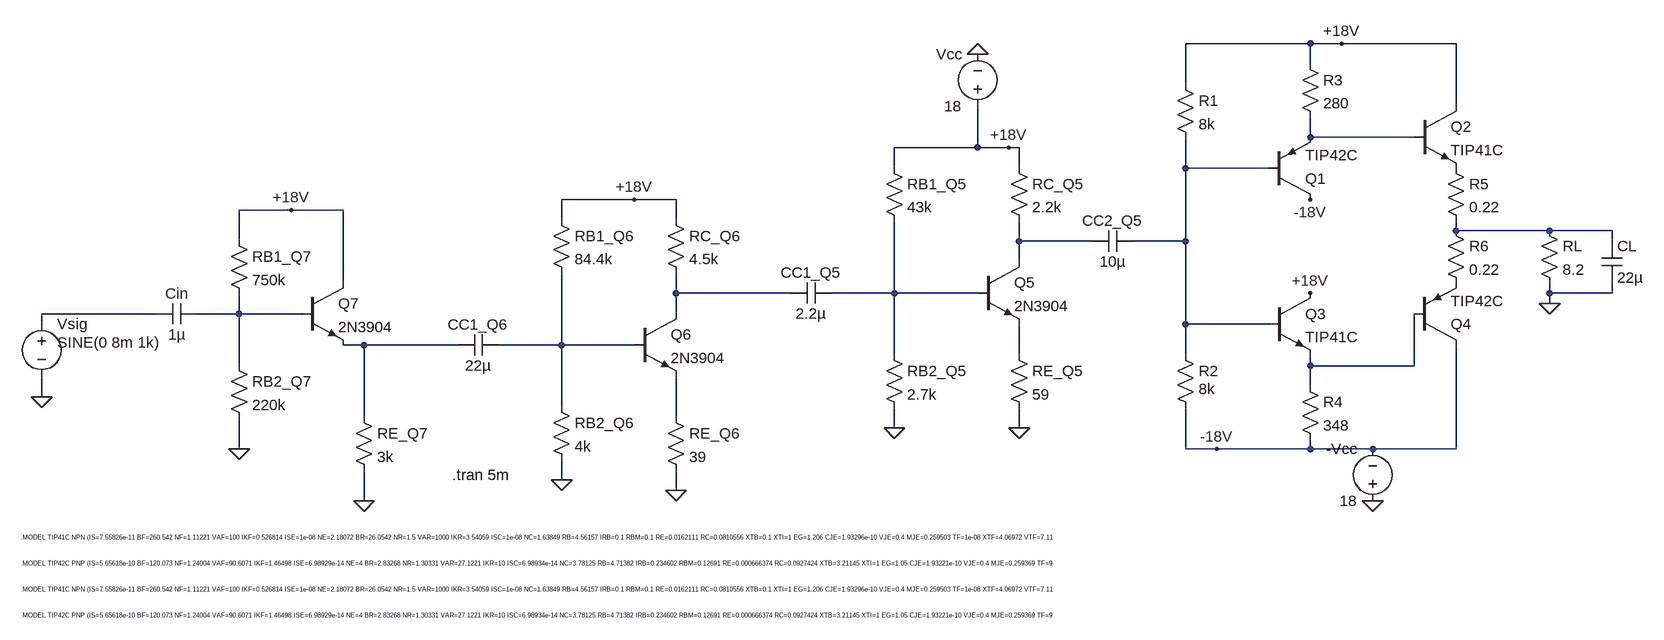
[diagram p0: schematic Simulation (LTSpice).asc]
Simulation (LTSpice).asc, the LTspice schematic file:
Version 4.1
SHEET 1 4752 884
WIRE 1568 -192 1376 -192
WIRE 1616 -192 1568 -192
WIRE 1792 -192 1616 -192
WIRE 1568 -160 1568 -192
WIRE 1376 -128 1376 -192
WIRE 1792 -96 1792 -192
WIRE 1568 -48 1568 -80
WIRE 1728 -48 1568 -48
WIRE 1056 -32 1056 -96
WIRE 1056 -32 928 -32
WIRE 1104 -32 1056 -32
WIRE 1120 -32 1104 -32
WIRE 928 0 928 -32
WIRE 1120 0 1120 -32
WIRE 1376 0 1376 -48
WIRE 1504 0 1376 0
WIRE 528 48 416 48
WIRE 592 48 528 48
WIRE 0 64 -80 64
WIRE 80 64 0 64
WIRE 416 80 416 48
WIRE 592 80 592 48
WIRE 1792 96 1792 80
WIRE 1936 96 1792 96
WIRE 2032 96 1936 96
WIRE -80 112 -80 64
WIRE 1120 112 1120 80
WIRE 1232 112 1120 112
WIRE 1376 112 1376 0
WIRE 1376 112 1296 112
WIRE 2032 112 2032 96
WIRE 1120 144 1120 112
WIRE 80 176 80 64
WIRE 592 192 592 160
WIRE 768 192 592 192
WIRE 928 192 928 80
WIRE 928 192 832 192
WIRE 1056 192 928 192
WIRE 1936 192 1936 176
WIRE 2032 192 2032 176
WIRE 2032 192 1936 192
WIRE 1936 208 1936 192
WIRE -208 224 -384 224
WIRE -80 224 -80 192
WIRE -80 224 -144 224
WIRE 16 224 -80 224
WIRE 592 224 592 192
WIRE -384 240 -384 224
WIRE 1376 240 1376 112
WIRE 1504 240 1376 240
WIRE 112 272 80 272
WIRE 256 272 112 272
WIRE 416 272 416 160
WIRE 416 272 320 272
WIRE 528 272 416 272
WIRE 928 288 928 192
WIRE 1120 288 1120 240
WIRE 1376 288 1376 240
WIRE -80 304 -80 224
WIRE 1568 304 1568 288
WIRE 1728 304 1728 224
WIRE 1728 304 1568 304
WIRE 1568 336 1568 304
WIRE -384 352 -384 320
WIRE 416 368 416 272
WIRE 112 384 112 272
WIRE 592 384 592 320
WIRE 928 400 928 368
WIRE 1120 400 1120 368
WIRE -80 432 -80 384
WIRE 1376 432 1376 368
WIRE 1424 432 1376 432
WIRE 1568 432 1568 416
WIRE 1568 432 1424 432
WIRE 1664 432 1568 432
WIRE 1792 432 1792 272
WIRE 1792 432 1664 432
WIRE 416 480 416 448
WIRE 592 496 592 464
WIRE 112 512 112 464
FLAG 928 400 0
FLAG 1056 -176 0
FLAG 1104 -32 +18V
FLAG 416 480 0
FLAG 528 48 +18V
FLAG -80 432 0
FLAG 112 512 0
FLAG -384 352 0
FLAG 1120 400 0
FLAG 592 496 0
FLAG 1936 208 0
FLAG 1616 -192 +18V
FLAG 1568 192 +18V
FLAG 1568 48 -18V
FLAG 1424 432 -18V
FLAG 1664 512 0
FLAG 0 64 +18V
SYMBOL npn 1056 144 R0
SYMATTR InstName Q5
SYMATTR Value 2N3904
SYMBOL res 1104 -16 R0
SYMATTR InstName RC_Q5
SYMATTR Value 2.2k
SYMBOL res 912 -16 R0
SYMATTR InstName RB1_Q5
SYMATTR Value 43k
SYMBOL res 912 272 R0
SYMATTR InstName RB2_Q5
SYMATTR Value 2.7k
SYMBOL res 1104 272 R0
SYMATTR InstName RE_Q5
SYMATTR Value 59
SYMBOL voltage 1056 -80 R180
WINDOW 0 24 96 Left 2
WINDOW 3 24 16 Left 2
WINDOW 123 0 0 Left 0
WINDOW 39 0 0 Left 0
SYMATTR InstName Vcc
SYMATTR Value 18
SYMBOL npn 528 224 R0
SYMATTR InstName Q6
SYMATTR Value 2N3904
SYMBOL res 576 64 R0
SYMATTR InstName RC_Q6
SYMATTR Value 4.5k
SYMBOL res 400 64 R0
SYMATTR InstName RB1_Q6
SYMATTR Value 84.4k
SYMBOL res 400 352 R0
SYMATTR InstName RB2_Q6
SYMATTR Value 4k
SYMBOL cap 1296 96 R90
WINDOW 0 0 32 VBottom 2
WINDOW 3 32 32 VTop 2
SYMATTR InstName CC2_Q5
SYMATTR Value 10µ
SYMBOL npn 16 176 R0
SYMATTR InstName Q7
SYMATTR Value 2N3904
SYMBOL res 96 368 R0
SYMATTR InstName RE_Q7
SYMATTR Value 3k
SYMBOL res -96 96 R0
SYMATTR InstName RB1_Q7
SYMATTR Value 750k
SYMBOL res -96 288 R0
SYMATTR InstName RB2_Q7
SYMATTR Value 220k
SYMBOL cap -144 208 R90
WINDOW 0 0 32 VBottom 2
WINDOW 3 32 32 VTop 2
SYMATTR InstName Cin
SYMATTR Value 1µ
SYMBOL voltage -384 224 R0
WINDOW 3 24 44 Left 2
WINDOW 123 24 44 Left 2
WINDOW 39 0 0 Left 0
SYMATTR Value SINE(0 8m 1k)
SYMATTR InstName Vsig
SYMBOL cap 320 256 R90
WINDOW 0 0 32 VBottom 2
WINDOW 3 32 32 VTop 2
SYMATTR InstName CC1_Q6
SYMATTR Value 22µ
SYMBOL cap 832 176 R90
WINDOW 0 0 32 VBottom 2
WINDOW 3 32 32 VTop 2
SYMATTR InstName CC1_Q5
SYMATTR Value 2.2µ
SYMBOL res 576 368 R0
SYMATTR InstName RE_Q6
SYMATTR Value 39
SYMBOL npn 1504 192 R0
SYMATTR InstName Q3
SYMATTR Value TIP41C
SYMBOL npn 1728 -96 R0
SYMATTR InstName Q2
SYMATTR Value TIP41C
SYMBOL pnp 1504 48 M180
SYMATTR InstName Q1
SYMATTR Value TIP42C
SYMBOL pnp 1728 272 M180
SYMATTR InstName Q4
SYMATTR Value TIP42C
SYMBOL res 1552 -176 R0
SYMATTR InstName R3
SYMATTR Value 280
SYMBOL res 1552 320 R0
SYMATTR InstName R4
SYMATTR Value 348
SYMBOL res 1776 -16 R0
SYMATTR InstName R5
SYMATTR Value 0.22
SYMBOL res 1776 80 R0
SYMATTR InstName R6
SYMATTR Value 0.22
SYMBOL res 1920 80 R0
SYMATTR InstName RL
SYMATTR Value 8.2
SYMATTR SpiceLine pwr=5
SYMBOL voltage 1664 528 R180
WINDOW 0 24 96 Left 2
WINDOW 3 24 16 Left 2
WINDOW 123 0 0 Left 0
WINDOW 39 0 0 Left 0
SYMATTR InstName -Vcc
SYMATTR Value 18
SYMBOL res 1360 -144 R0
SYMATTR InstName R1
SYMATTR Value 8k
SYMBOL res 1360 272 R0
WINDOW 3 36 68 Left 2
SYMATTR Value 8k
SYMATTR InstName R2
SYMBOL cap 2016 112 R0
SYMATTR InstName CL
SYMATTR Value 22µ
TEXT 248 472 Left 2 !.tran 5m
TEXT -416 568 Left 0 !.MODEL TIP41C NPN (IS=7.55826e-11 BF=260.542 NF=1.11221 VAF=100 IKF=0.526814 ISE=1e-08 NE=2.18072 BR=26.0542 NR=1.5 VAR=1000 IKR=3.54059 ISC=1e-08 NC=1.63849 RB=4.56157 IRB=0.1 RBM=0.1 RE=0.0162111 RC=0.0810556 XTB=0.1 XTI=1 EG=1.206 CJE=1.93296e-10 VJE=0.4 MJE=0.259503 TF=1e-08 XTF=4.06972 VTF=7.1157 ITF=0.001 CJC=1.09657e-10 VJC=0.730921 MJC=0.23 XCJC=0.803085 FC=0.8 TR=9.01013e-08 PTF=0 Vceo=100 ICrating=6 mfg=ON_Semi)
TEXT -416 608 Left 0 !.MODEL TIP42C PNP (IS=5.65618e-10 BF=120.073 NF=1.24004 VAF=90.6071 IKF=1.46498 ISE=6.98929e-14 NE=4 BR=2.83268 NR=1.30331 VAR=27.1221 IKR=10 ISC=6.98934e-14 NC=3.78125 RB=4.71382 IRB=0.234602 RBM=0.12691 RE=0.000666374 RC=0.0927424 XTB=3.21145 XTI=1 EG=1.05 CJE=1.93221e-10 VJE=0.4 MJE=0.259369 TF=9.99163e-09 XTF=4.41941 VTF=6.53488 ITF=0.001 CJC=1.0962e-10 VJC=0.731968 MJC=0.23 XCJC=0.799902 FC=0.799995 TR=1e-07 PTF=0 KF=0 Vceo=100 ICrating=6 mfg=ON_Semi)
TEXT -416 648 Left 0 !.MODEL TIP41C NPN (IS=7.55826e-11 BF=260.542 NF=1.11221 VAF=100 IKF=0.526814 ISE=1e-08 NE=2.18072 BR=26.0542 NR=1.5 VAR=1000 IKR=3.54059 ISC=1e-08 NC=1.63849 RB=4.56157 IRB=0.1 RBM=0.1 RE=0.0162111 RC=0.0810556 XTB=0.1 XTI=1 EG=1.206 CJE=1.93296e-10 VJE=0.4 MJE=0.259503 TF=1e-08 XTF=4.06972 VTF=7.1157 ITF=0.001 CJC=1.09657e-10 VJC=0.730921 MJC=0.23 XCJC=0.803085 FC=0.8 TR=9.01013e-08 PTF=0 Vceo=100 ICrating=6 mfg=ON_Semi)
TEXT -416 688 Left 0 !.MODEL TIP42C PNP (IS=5.65618e-10 BF=120.073 NF=1.24004 VAF=90.6071 IKF=1.46498 ISE=6.98929e-14 NE=4 BR=2.83268 NR=1.30331 VAR=27.1221 IKR=10 ISC=6.98934e-14 NC=3.78125 RB=4.71382 IRB=0.234602 RBM=0.12691 RE=0.000666374 RC=0.0927424 XTB=3.21145 XTI=1 EG=1.05 CJE=1.93221e-10 VJE=0.4 MJE=0.259369 TF=9.99163e-09 XTF=4.41941 VTF=6.53488 ITF=0.001 CJC=1.0962e-10 VJC=0.731968 MJC=0.23 XCJC=0.799902 FC=0.799995 TR=1e-07 PTF=0 KF=0 Vceo=100 ICrating=6 mfg=ON_Semi)

The netlist it stands for:
* Simulation (LTSpice).asc
Q5 N004 N006 N011 0 2N3904
RC_Q5 +18V N004 2.2k
RB1_Q5 +18V N006 43k
RB2_Q5 N006 0 2.7k
RE_Q5 N011 0 59
Vcc +18V 0 18
Q6 N005 N010 N013 0 2N3904
RC_Q6 +18V N005 4.5k
RB1_Q6 +18V N010 84.4k
RB2_Q6 N010 0 4k
CC2_Q5 N002 N004 10µ
Q7 +18V N008 N009 0 2N3904
RE_Q7 N009 0 3k
RB1_Q7 +18V N008 750k
RB2_Q7 N008 0 220k
Cin N008 N007 1µ
Vsig N007 0 SINE(0 8m 1k)
CC1_Q6 N010 N009 22µ
CC1_Q5 N006 N005 2.2µ
RE_Q6 N013 0 39
Q3 +18V N002 N012 0 TIP41C
Q2 +18V N001 P001 0 TIP41C
Q1 -18V N002 N001 0 TIP42C
Q4 -18V N012 P002 0 TIP42C
R3 +18V N001 280
R4 N012 -18V 348
R5 P001 N003 0.22
R6 N003 P002 0.22
RL N003 0 8.2 pwr=5
V§-Vcc 0 -18V 18
R1 +18V N002 8k
R2 N002 -18V 8k
CL N003 0 22µ
.model NPN NPN
.model PNP PNP
.lib standard.bjt
.tran 5m
.MODEL TIP41C NPN (IS=7.55826e-11 BF=260.542 NF=1.11221 VAF=100 IKF=0.526814 ISE=1e-08 NE=2.18072 BR=26.0542 NR=1.5 VAR=1000 IKR=3.54059 ISC=1e-08 NC=1.63849 RB=4.56157 IRB=0.1 RBM=0.1 RE=0.0162111 RC=0.0810556 XTB=0.1 XTI=1 EG=1.206 CJE=1.93296e-10 VJE=0.4 MJE=0.259503 TF=1e-08 XTF=4.06972 VTF=7.1157 ITF=0.001 CJC=1.09657e-10 VJC=0.730921 MJC=0.23 XCJC=0.803085 FC=0.8 TR=9.01013e-08 PTF=0 Vceo=100 ICrating=6 mfg=ON_Semi)
.MODEL TIP42C PNP (IS=5.65618e-10 BF=120.073 NF=1.24004 VAF=90.6071 IKF=1.46498 ISE=6.98929e-14 NE=4 BR=2.83268 NR=1.30331 VAR=27.1221 IKR=10 ISC=6.98934e-14 NC=3.78125 RB=4.71382 IRB=0.234602 RBM=0.12691 RE=0.000666374 RC=0.0927424 XTB=3.21145 XTI=1 EG=1.05 CJE=1.93221e-10 VJE=0.4 MJE=0.259369 TF=9.99163e-09 XTF=4.41941 VTF=6.53488 ITF=0.001 CJC=1.0962e-10 VJC=0.731968 MJC=0.23 XCJC=0.799902 FC=0.799995 TR=1e-07 PTF=0 KF=0 Vceo=100 ICrating=6 mfg=ON_Semi)
.MODEL TIP41C NPN (IS=7.55826e-11 BF=260.542 NF=1.11221 VAF=100 IKF=0.526814 ISE=1e-08 NE=2.18072 BR=26.0542 NR=1.5 VAR=1000 IKR=3.54059 ISC=1e-08 NC=1.63849 RB=4.56157 IRB=0.1 RBM=0.1 RE=0.0162111 RC=0.0810556 XTB=0.1 XTI=1 EG=1.206 CJE=1.93296e-10 VJE=0.4 MJE=0.259503 TF=1e-08 XTF=4.06972 VTF=7.1157 ITF=0.001 CJC=1.09657e-10 VJC=0.730921 MJC=0.23 XCJC=0.803085 FC=0.8 TR=9.01013e-08 PTF=0 Vceo=100 ICrating=6 mfg=ON_Semi)
.MODEL TIP42C PNP (IS=5.65618e-10 BF=120.073 NF=1.24004 VAF=90.6071 IKF=1.46498 ISE=6.98929e-14 NE=4 BR=2.83268 NR=1.30331 VAR=27.1221 IKR=10 ISC=6.98934e-14 NC=3.78125 RB=4.71382 IRB=0.234602 RBM=0.12691 RE=0.000666374 RC=0.0927424 XTB=3.21145 XTI=1 EG=1.05 CJE=1.93221e-10 VJE=0.4 MJE=0.259369 TF=9.99163e-09 XTF=4.41941 VTF=6.53488 ITF=0.001 CJC=1.0962e-10 VJC=0.731968 MJC=0.23 XCJC=0.799902 FC=0.799995 TR=1e-07 PTF=0 KF=0 Vceo=100 ICrating=6 mfg=ON_Semi)
.backanno
.end